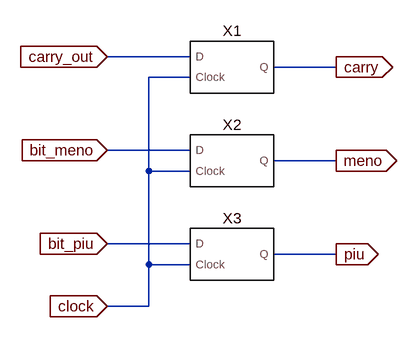
[diagram p0: schematic master_slave_3bit.asc]
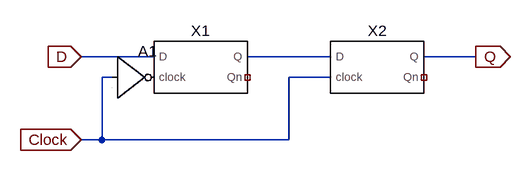
[diagram p1: sub-circuit master_slave.asc]
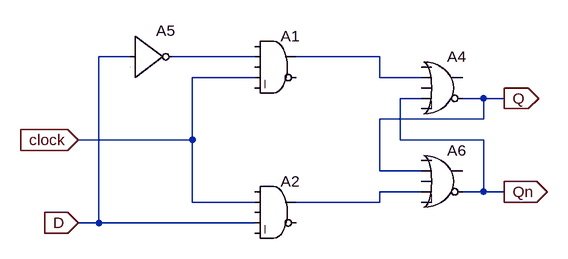
[diagram p2: sub-circuit d_latch.asc]
master_slave_3bit.asc, the LTspice schematic file:
Version 4
SHEET 1 880 680
WIRE 32 112 -96 112
WIRE 256 128 160 128
WIRE 32 144 -32 144
WIRE 32 256 -96 256
WIRE 256 272 160 272
WIRE -32 288 -32 144
WIRE 32 288 -32 288
WIRE 32 400 -96 400
WIRE 256 416 160 416
WIRE -32 432 -32 288
WIRE 32 432 -32 432
WIRE -32 496 -32 432
WIRE -32 496 -96 496
FLAG -96 496 clock
IOPIN -96 496 In
FLAG -96 400 bit_piu
IOPIN -96 400 In
FLAG -96 256 bit_meno
IOPIN -96 256 In
FLAG -96 112 carry_out
IOPIN -96 112 In
FLAG 256 128 carry
IOPIN 256 128 Out
FLAG 256 272 meno
IOPIN 256 272 Out
FLAG 256 416 piu
IOPIN 256 416 Out
SYMBOL master_slave 96 128 R0
SYMATTR InstName X1
SYMBOL master_slave 96 272 R0
SYMATTR InstName X2
SYMBOL master_slave 96 416 R0
SYMATTR InstName X3

master_slave.asc, the sub-circuit schematic file:
Version 4
SHEET 1 880 680
WIRE 16 128 -96 128
WIRE 288 128 160 128
WIRE 512 128 432 128
WIRE -48 160 -64 160
WIRE 288 160 224 160
WIRE -64 256 -64 160
WIRE -64 256 -96 256
WIRE 224 256 224 160
WIRE 224 256 -64 256
FLAG -96 128 D
IOPIN -96 128 In
FLAG -96 256 Clock
IOPIN -96 256 In
FLAG 512 128 Q
IOPIN 512 128 Out
SYMBOL d_latch 80 144 R0
SYMATTR InstName X1
SYMBOL d_latch 352 144 R0
SYMATTR InstName X2
SYMBOL Digital\\inv -48 96 R0
SYMATTR InstName A1

d_latch.asc, the sub-circuit schematic file:
Version 4
SHEET 1 880 680
WIRE -128 96 -176 96
WIRE 64 96 -64 96
WIRE 256 96 128 96
WIRE 64 128 -32 128
WIRE 256 128 256 96
WIRE 320 128 256 128
WIRE 320 160 288 160
WIRE 416 160 384 160
WIRE 448 160 416 160
WIRE 416 192 416 160
WIRE 416 192 256 192
WIRE -32 224 -32 128
WIRE -32 224 -208 224
WIRE 288 224 288 160
WIRE 416 224 288 224
WIRE 256 272 256 192
WIRE 320 272 256 272
WIRE 320 304 256 304
WIRE 416 304 416 224
WIRE 416 304 384 304
WIRE 448 304 416 304
WIRE -32 320 -32 224
WIRE 64 320 -32 320
WIRE 256 320 256 304
WIRE 256 320 128 320
WIRE -176 352 -176 96
WIRE -176 352 -208 352
WIRE 64 352 -176 352
FLAG -208 224 clock
IOPIN -208 224 In
FLAG -208 352 D
IOPIN -208 352 In
FLAG 448 160 Q
IOPIN 448 160 Out
FLAG 448 304 Qn
IOPIN 448 304 Out
SYMBOL Digital\\and 96 48 R0
SYMATTR InstName A1
SYMBOL Digital\\and 96 272 R0
SYMATTR InstName A2
SYMBOL Digital\\inv -128 32 R0
SYMATTR InstName A5
SYMBOL Digital\\or 352 80 R0
SYMATTR InstName A4
SYMBOL Digital\\or 352 224 R0
SYMATTR InstName A6

The netlist it stands for:
* master_slave_3bit.asc
XX1 clock carry_out carry master_slave params: master_slave
XX2 clock bit_meno meno master_slave params: master_slave
XX3 clock bit_piu piu master_slave params: master_slave

* block symbol definitions
.subckt master_slave Clock D Q
XX1 P001 D N001 NC_01 d_latch params: d_latch
XX2 Clock N001 Q NC_02 d_latch params: d_latch
A1 Clock 0 0 0 0 P001 0 0 BUF
.ends master_slave

.subckt d_latch clock D Q Qn
A1 0 N001 0 clock 0 0 N002 0 AND
A2 0 clock 0 D 0 0 N003 0 AND
A5 D 0 0 0 0 N001 0 0 BUF
A4 0 N002 0 Qn 0 Q 0 0 OR
A6 0 Q 0 N003 0 Qn 0 0 OR
.ends d_latch

.backanno
.end